# EAGLE design ATTinyServo_v12 (EAGLE 6.4)
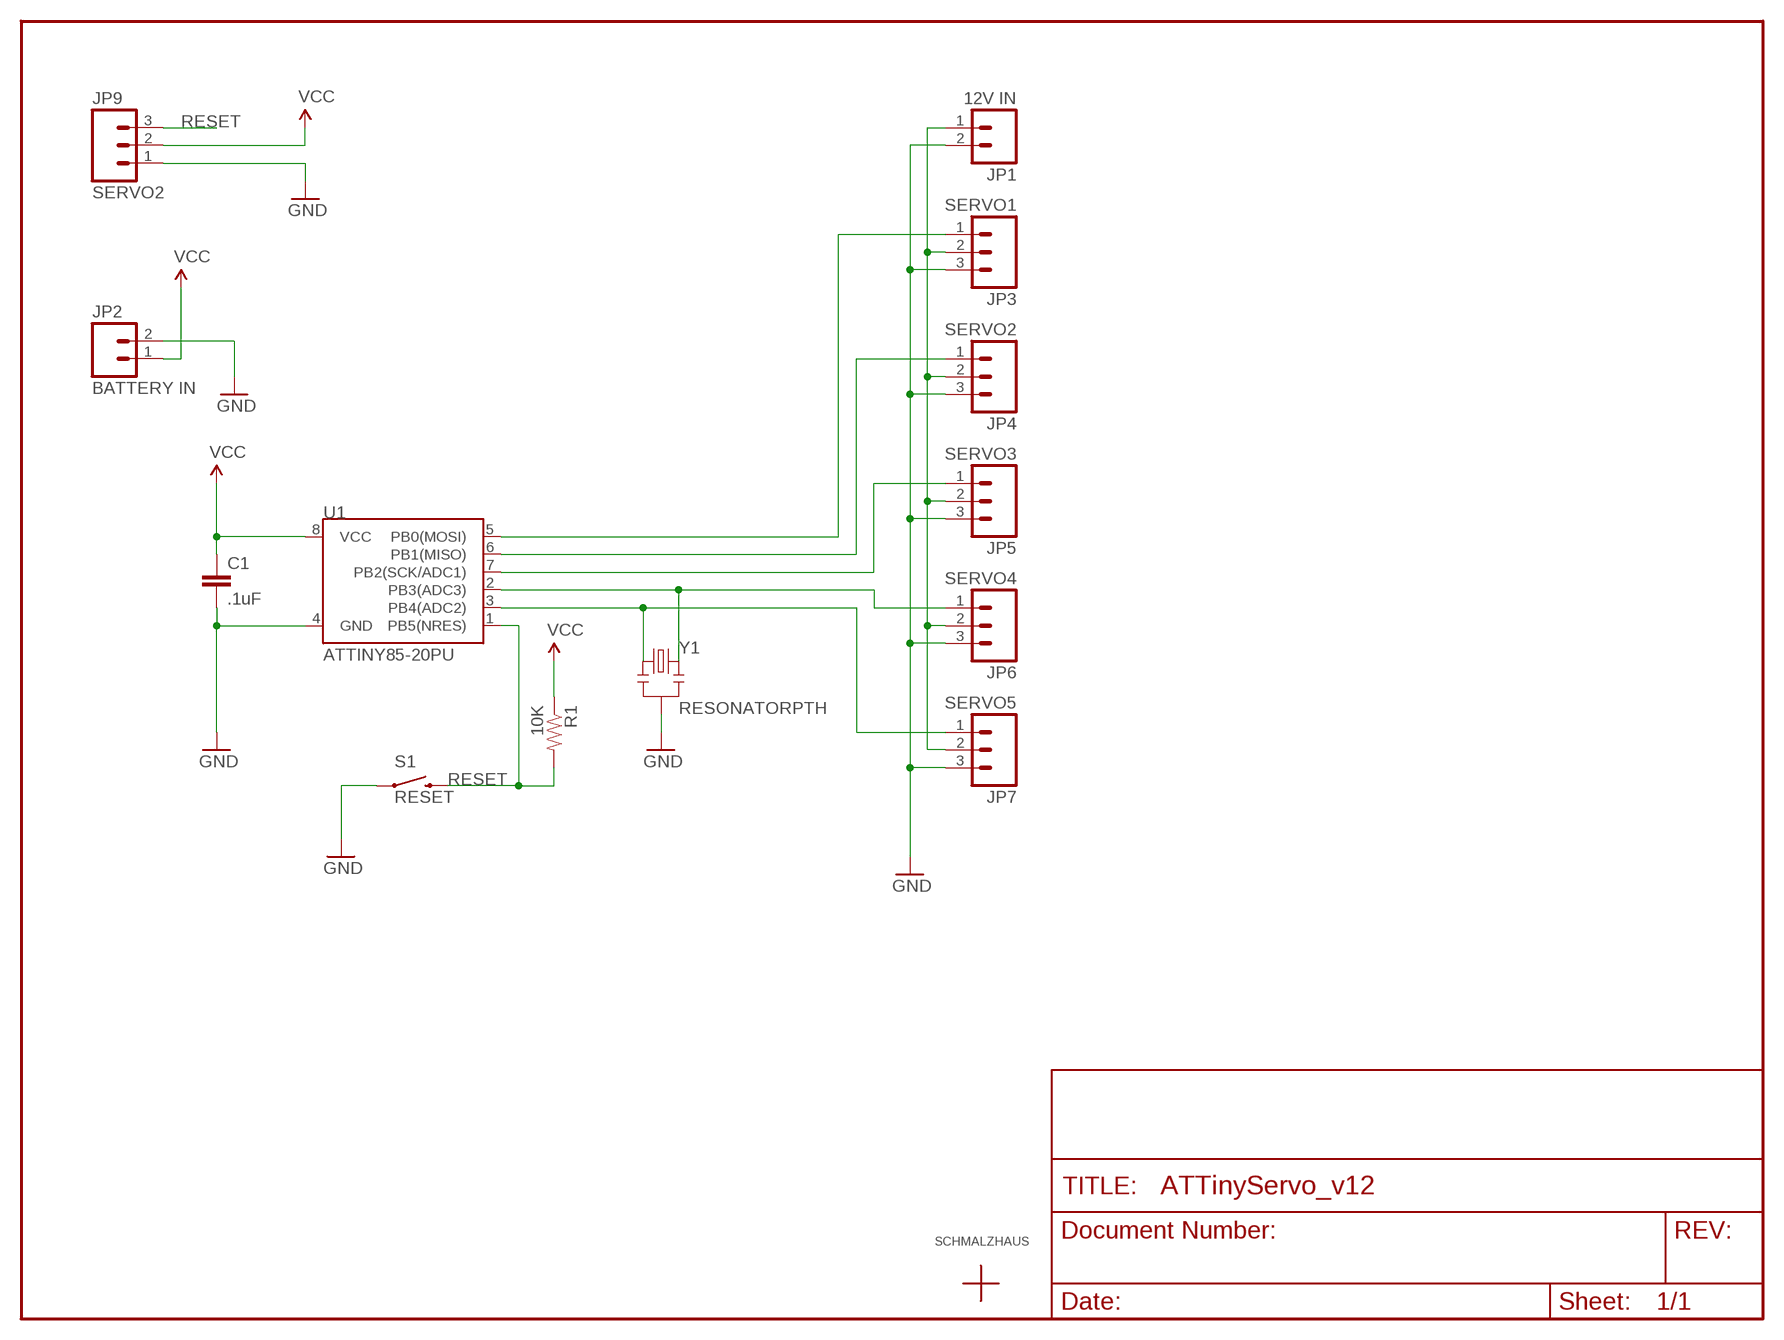
[diagram p0: schematic, sheet 1]

## Parts
C1  .1uF  CAPKIT  [CAP-PTH-SMALL-KIT]
JP1  12V IN  M023.5MM  [SCREWTERMINAL-3.5MM-2]
JP2  BATTERY IN  M023.5MM  [SCREWTERMINAL-3.5MM-2]
JP3  SERVO1  M03PTH  [1X03]
JP4  SERVO2  M03PTH  [1X03]
JP5  SERVO3  M03PTH  [1X03]
JP6  SERVO4  M03PTH  [1X03]
JP7  SERVO5  M03PTH  [1X03]
JP9  SERVO2  M03PTH  [1X03]
R1  10K  RESISTORPTH-1/4W  [AXIAL-0.4]
S1  RESET  SWITCH-MOMENTARY-2PTH  [TACTILE-PTH]
U1  ATTINY85-20PU  ATTINY45DIP8  [DIP08]
U$1  SCHMALZHAUSSCHMALZHAUS_SMALL  [SCHMALZHAUS_SMALL]
Y1  RESONATORPTH  [RESONATOR-PTH]

## Nets
GND: C1.2 JP1.2 JP2.2 JP3.3 JP4.3 JP5.3 JP6.3 JP7.3 JP9.1 S1.1 U1.4(GND) Y1.2
N$1: JP1.1 JP3.2 JP4.2 JP5.2 JP6.2 JP7.2
N$2: JP6.1 U1.2(PB3(ADC3)) Y1.3
N$3: JP7.1 U1.3(PB4(ADC2)) Y1.1
N$7: JP5.1 U1.7(PB2(SCK/ADC1))
N$8: JP4.1 U1.6(PB1(MISO))
N$9: JP3.1 U1.5(PB0(MOSI))
RESET: JP9.3 R1.P$2 S1.3 U1.1(PB5(NRES))
VCC: C1.1 JP2.1 JP9.2 R1.P$1 U1.8(VCC)

## Library data of the parts
C1 = SparkFun-Capacitors:CAP: Capacitor Standard 0603 ceramic capacitor, and 0.1" leaded capacitor.
JP1 JP2 = SparkFun:M02: Header 2 Standard 2-pin 0.1" header. Use with straight break away headers (SKU : PRT-00116), right angle break away headers (PRT-00553), swiss pins (PRT-00743), machine pins (PRT-00117), and female headers (PRT-00115). Molex polarized connector foot print use with SKU : PRT-08233 with associated crimp pins and housings.
JP3-JP7 JP9 = SparkFun:M03: Header 3 Standard 3-pin 0.1" header. Use with straight break away headers (SKU : PRT-00116), right angle break away headers (PRT-00553), swiss pins (PRT-00743), machine pins (PRT-00117), and female headers (PRT-00115). Molex polarized connector foot print use with SKU : PRT-08232 with associated crimp pins and housings.
R1 = SparkFun:RESISTOR: Resistor Basic schematic elements and footprints for 0603, 1206, and PTH resistors.
S1 = SparkFun:SWITCH-MOMENTARY-2
U1 = SparkFun:ATTINY45: Atmel ATTiny45
U$1 = SchmalzHaus:SCHMALZHAUS
Y1 = SparkFun:RESONATOR: Resonator Small SMD resonator. This is the itty bitty 10/20MHz resonators with built in caps. CSTCE10M0G55 and CSTCE20M0V53. Footprint has been reviewed closely but hasn't been tested yet.

## Board
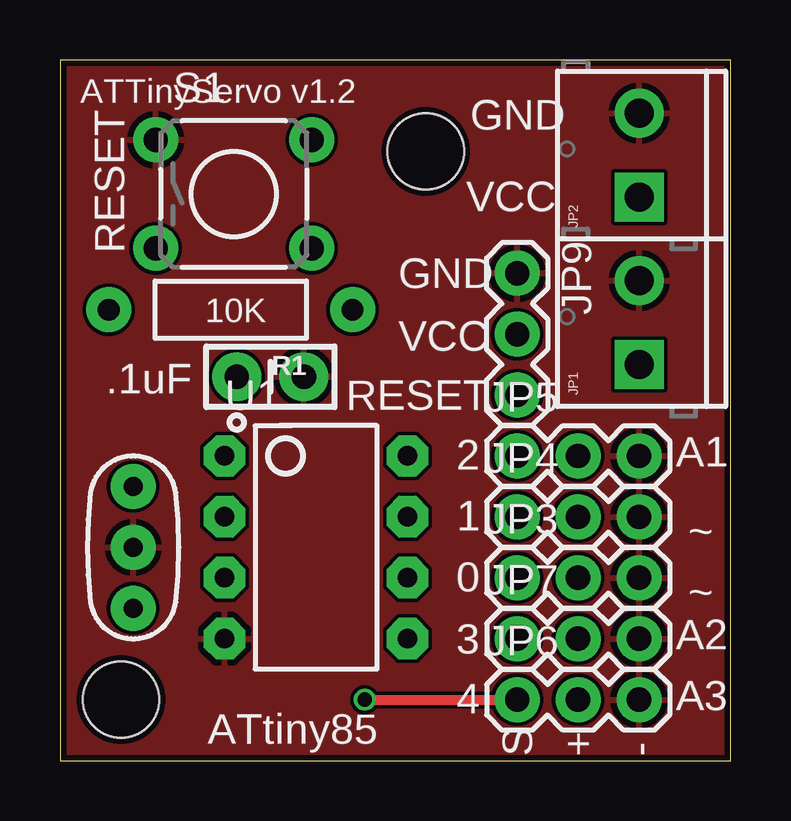
[diagram p1: board, top side]
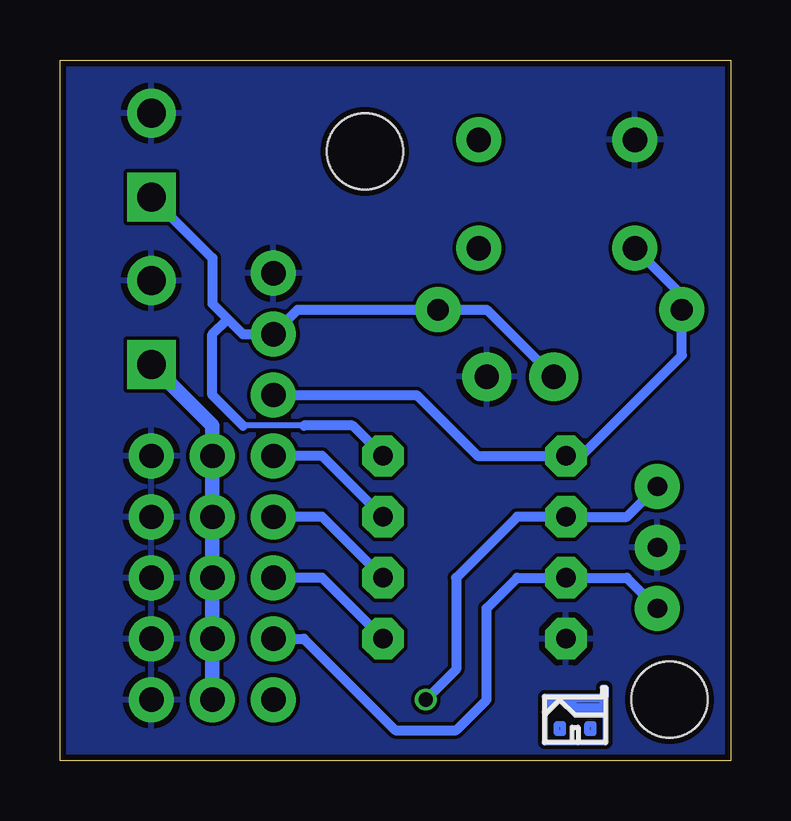
[diagram p2: board, bottom side, seen from below]

Size 27.94 x 29.21 mm. Coordinates in mm from the lower left corner, seen from the top.
Outline: 0,0 27.94,0 27.94,29.21 0,29.21 0,0
Copper layers (1*16): Top 0.035mm / dielectric 1.5mm / Bottom 0.035mm
Design rules "Fusion_eagle_rule_v1.1": minimum track width 6mil, minimum drill 12mil, track to track 6mil, track to pad 6mil, pad to pad 6mil, via to via 6mil, smd to smd 0mil, copper to edge 10mil, drill to drill 10mil, minimum pad ring 10mil, minimum via ring 6mil, stop-mask expansion 2mil, vias tented up to drill 100mil, thermal gap 10mil
Holes 3.17 mm at 2.54,2.54 15.24,25.4

### Footprints (pad centres in the part's own frame; a part is rotated, then mirrored left to right if it is on the bottom)
CAP-PTH-SMALL-KIT = drill 1.016 pad 2.032: 1 -1.397,0; 2 1.397,0
SCREWTERMINAL-3.5MM-2 = drill 1.2 pad 2.032 square: 1 0,0 | drill 1.2 pad 2.032: 2 3.5,0
1X03 = drill 1.016 pad 1.88: 1 0,0; 2 2.54,0; 3 5.08,0
AXIAL-0.4 = drill 0.9 pad 1.88: P$1 -5.08,0; P$2 5.08,0
TACTILE-PTH = drill 1.016 pad 1.88: 1 -3.251,2.261; 2 3.251,2.261; 3 -3.251,-2.261; 4 3.251,-2.261
DIP08 = drill 0.813 pad 1.727 octagon: 1 -3.81,-3.81; 2 -1.27,-3.81; 3 1.27,-3.81; 4 3.81,-3.81; 5 3.81,3.81; 6 1.27,3.81; 7 -1.27,3.81; 8 -3.81,3.81
RESONATOR-PTH = drill 0.8 pad 1.88: 1 -2.54,0; 2 0,0; 3 2.54,0

### Placement (x,y rotation side)
C1  8.76,16 0 top
JP1  24.13,16.51 90 top
JP2  24.13,23.5 90 top
JP3  19.05,7.62 0 top
JP4  19.05,10.16 0 top
JP5  19.05,12.7 0 top
JP6  19.05,2.54 0 top
JP7  19.05,5.08 0 top
JP9  19.05,20.32 270 top
R1  7.11,18.8 180 top
S1  7.24,23.62 0 top
U1  10.67,8.89 270 top
U$1  6.48,0.76 0 bottom
Y1  3.05,8.89 90 top

### Tracks (layer width: path | path; a pad name or v marks a point on that pad's centre or on a via)
GND
  pour Top: 0,0 27.94,0 27.94,29.21 0,29.21
  pour Bottom: 0,0 27.94,0 27.94,29.21 0,29.21
N$1
  Bottom 0.61: JP1.1 21.59,13.97 JP5.2 JP4.2 JP3.2 JP6.2 JP7.2
N$2  (via drill 0.6)
  Top 0.406: v12.7,2.54 JP6.1
  Bottom 0.406: Y1.3 4.32,10.16 U1.2 8.89,10.16 11.43,7.62 11.43,3.81 v12.7,2.54
N$3
  Bottom 0.406: Y1.1 4.32,7.62 U1.3 8.89,7.62 10.16,6.35 10.16,2.54 11.43,1.27 13.97,1.27 17.78,5.08 JP7.1
N$7
  Bottom 0.406: U1.7 17.02,12.7 JP5.1
N$8
  Bottom 0.406: U1.6 17.02,10.16 JP4.1
N$9
  Bottom 0.406: U1.5 17.02,7.62 JP3.1
RESET
  Bottom 0.406: JP9.3 13.08,15.24 10.54,12.7 U1.1 6.22,12.7 2.03,16.89 R1.P$2 2.03,19.41 S1.3
VCC
  Bottom 0.254: 17.78,13.97 20.32,13.97
  Bottom 0.406: JP2.1 21.59,20.95 21.59,19.05 20.95,18.41 | 20.95,18.41 20.32,17.78 JP9.2 18.03,18.8 R1.P$1 10.16,18.8 C1.1 | U1.8 15.75,13.97 17.78,13.97 | 20.32,13.97 21.59,15.24 21.59,17.78 20.95,18.41

### Text on the board
tPlace: ATTinyServo v1.2 | GND | VCC | RESET | GND | VCC | .1uF | RESET | 2 | A1 | 1 | ~ | 0 | ~ | A2 | 3 | 4 | A3 | ATtiny85 | S | + | -